# EAGLE design detection_input (EAGLE 7.6.0)
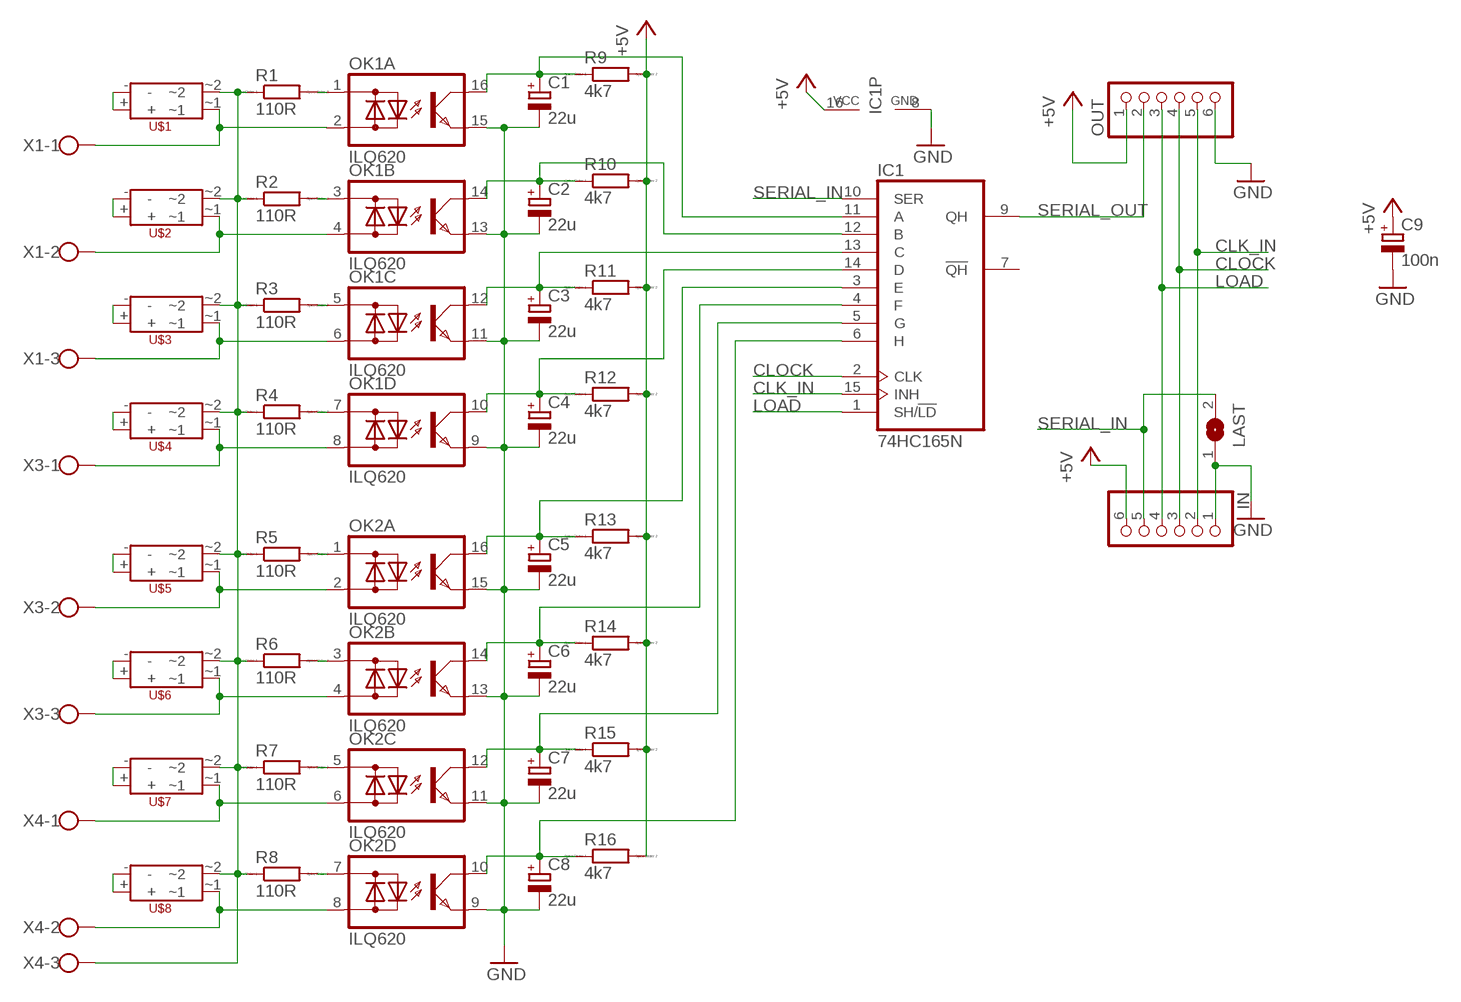
[diagram p0: schematic, sheet 1]

## Parts
C1  22u  CPOL-EUE2-4  [E2-4]
C2  22u  CPOL-EUE2-4  [E2-4]
C3  22u  CPOL-EUE2-4  [E2-4]
C4  22u  CPOL-EUE2-4  [E2-4]
C5  22u  CPOL-EUE2-4  [E2-4]
C6  22u  CPOL-EUE2-4  [E2-4]
C7  22u  CPOL-EUE2-4  [E2-4]
C8  22u  CPOL-EUE2-4  [E2-4]
C9  100n  CPOL-EUA/3216-18W  [A/3216-18W]
IC1  74HC165N  [DIL16]
IN  PINHD-1X6  [1X06]
LAST  SJ  [SJ]
OK1  ILQ620  [DIL16]
OK2  ILQ620  [DIL16]
OUT  PINHD-1X6  [1X06]
R1  110R  R0204/7  [0204/7]
R2  110R  R0204/7  [0204/7]
R3  110R  R0204/7  [0204/7]
R4  110R  R0204/7  [0204/7]
R5  110R  R0204/7  [0204/7]
R6  110R  R0204/7  [0204/7]
R7  110R  R0204/7  [0204/7]
R8  110R  R0204/7  [0204/7]
R9  4k7  R0204/7  [0204/7]
R10  4k7  R0204/7  [0204/7]
R11  4k7  R0204/7  [0204/7]
R12  4k7  R0204/7  [0204/7]
R13  4k7  R0204/7  [0204/7]
R14  4k7  R0204/7  [0204/7]
R15  4k7  R0204/7  [0204/7]
R16  4k7  R0204/7  [0204/7]
U$1  2W10  [2W10]
U$2  2W10  [2W10]
U$3  2W10  [2W10]
U$4  2W10  [2W10]
U$5  2W10  [2W10]
U$6  2W10  [2W10]
U$7  2W10  [2W10]
U$8  2W10  [2W10]
X1  W237-103  [W237-103]
X3  W237-103  [W237-103]
X4  W237-103  [W237-103]

## Nets
+5V: C9.+ IC1.16(VCC) IN.6 OUT.1 R9.2 R10.2 R11.2 R12.2 R13.2 R14.2 R15.2 R16.2
CLK_IN: IC1.15(INH) IN.2 OUT.5
CLOCK: IC1.2(CLK) IN.3 OUT.4
GND: C1.- C2.- C3.- C4.- C5.- C6.- C7.- C8.- C9.- IC1.8(GND) IN.1 LAST.1 OK1.9(D:E) OK1.11(C:E) OK1.13(B:E) OK1.15(A:E) OK2.9(D:E) OK2.11(C:E) OK2.13(B:E) OK2.15(A:E) OUT.6
LOAD: IC1.1(SH/!LD) IN.4 OUT.3
N$1: U$1.+ U$1.-
N$2: OK1.7(D:AC1) R4.2
N$3: OK1.5(C:AC1) R3.2
N$4: OK1.2(A:AC2) U$1.~1 X1.1
N$5: U$2.+ U$2.-
N$6: OK1.3(B:AC1) R2.2
N$7: OK1.1(A:AC1) R1.2
N$8: OK1.4(B:AC2) U$2.~1 X1.2
N$9: U$3.+ U$3.-
N$10: OK2.7(D:AC1) R8.2
N$11: OK2.5(C:AC1) R7.2
N$12: OK1.6(C:AC2) U$3.~1 X1.3
N$13: U$4.+ U$4.-
N$14: OK2.3(B:AC1) R6.2
N$15: OK1.8(D:AC2) U$4.~1 X3.1
N$16: U$5.+ U$5.-
N$17: R1.1 R2.1 R3.1 R4.1 R5.1 R6.1 R7.1 R8.1 U$1.~2 U$2.~2 U$3.~2 U$4.~2 U$5.~2 U$6.~2 U$7.~2 U$8.~2 X4.3
N$18: OK2.1(A:AC1) R5.2
N$19: OK2.2(A:AC2) U$5.~1 X3.2
N$20: U$6.+ U$6.-
N$21: C8.+ IC1.6(H) OK2.10(D:C) R16.1
N$22: OK2.4(B:AC2) U$6.~1 X3.3
N$23: U$7.+ U$7.-
N$24: C7.+ IC1.5(G) OK2.12(C:C) R15.1
N$25: C6.+ IC1.4(F) OK2.14(B:C) R14.1
N$26: OK2.6(C:AC2) U$7.~1 X4.1
N$27: U$8.+ U$8.-
N$28: C5.+ IC1.3(E) OK2.16(A:C) R13.1
N$29: OK2.8(D:AC2) U$8.~1 X4.2
N$30: C4.+ IC1.14(D) OK1.10(D:C) R12.1
N$31: C3.+ IC1.13(C) OK1.12(C:C) R11.1
N$32: C2.+ IC1.12(B) OK1.14(B:C) R10.1
N$33: C1.+ IC1.11(A) OK1.16(A:C) R9.1
SERIAL_IN: IC1.10(SER) IN.5 LAST.2
SERIAL_OUT: IC1.9(QH) OUT.2
Unconnected: IC1.7(!QH)

## Library data of the parts
C1-C9 = resistor:CPOL-EU: POLARIZED CAPACITOR, European symbol
IC1 = 74xx-eu:74*165: 8-bit parallel load SHIFT REGISTER
IN OUT = pinhead:PINHD-1X6: PIN HEADER
LAST = jumper:SJ: SMD solder JUMPER
OK1 OK2 = optocoupler:ILQ620: SIEMENS OPTO COUPLER; MF: VISHAY/TELEFUNKEN; MPN: ILQ620; OC_FARNELL: 1612470; OC_NEWARK: 58K1694
R1-R16 = eagle-ltspice:R: RESISTOR, European symbol; SPICEMODEL: NONE; SPICEPREFIX: R
U$1-U$8 = Custom:2W10
X1 X3 X4 = con-wago-500:W237-103: WAGO SCREW CLAMP; MPN: 237-103; OC_FARNELL: unknown; OC_NEWARK: 18M7116

## Board
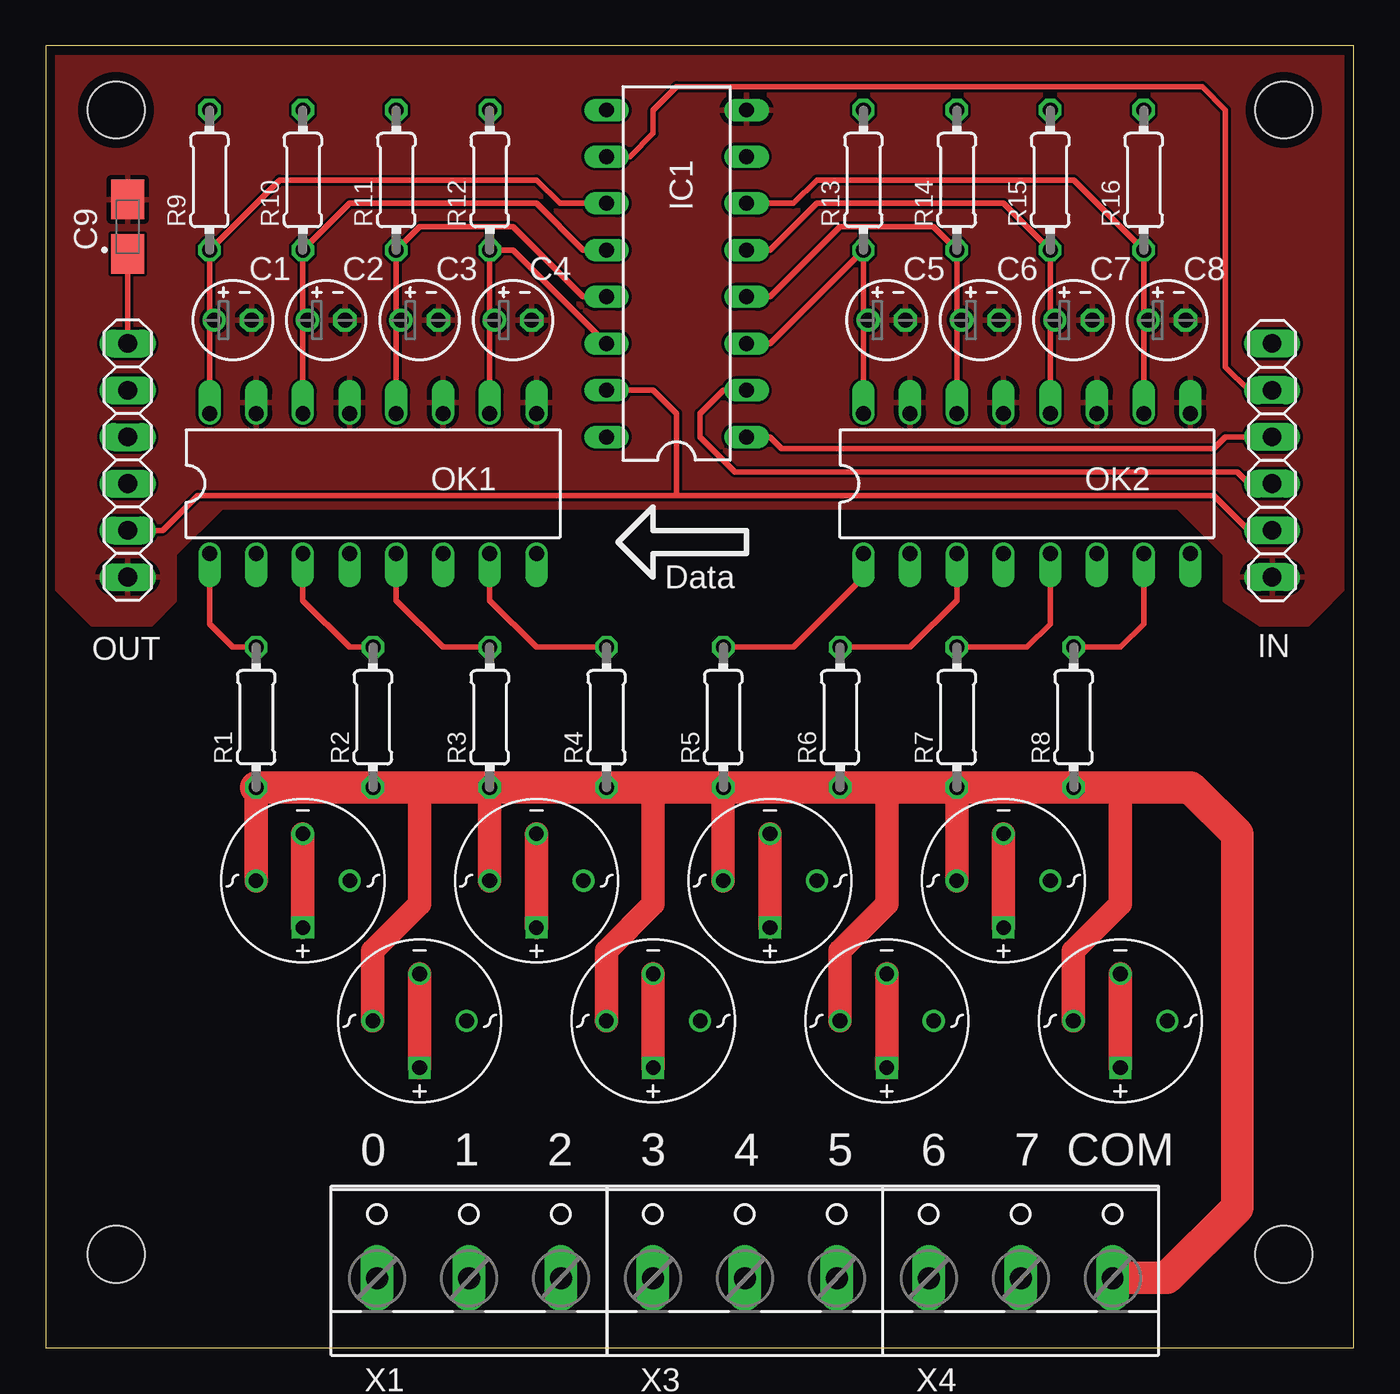
[diagram p1: board, top side]
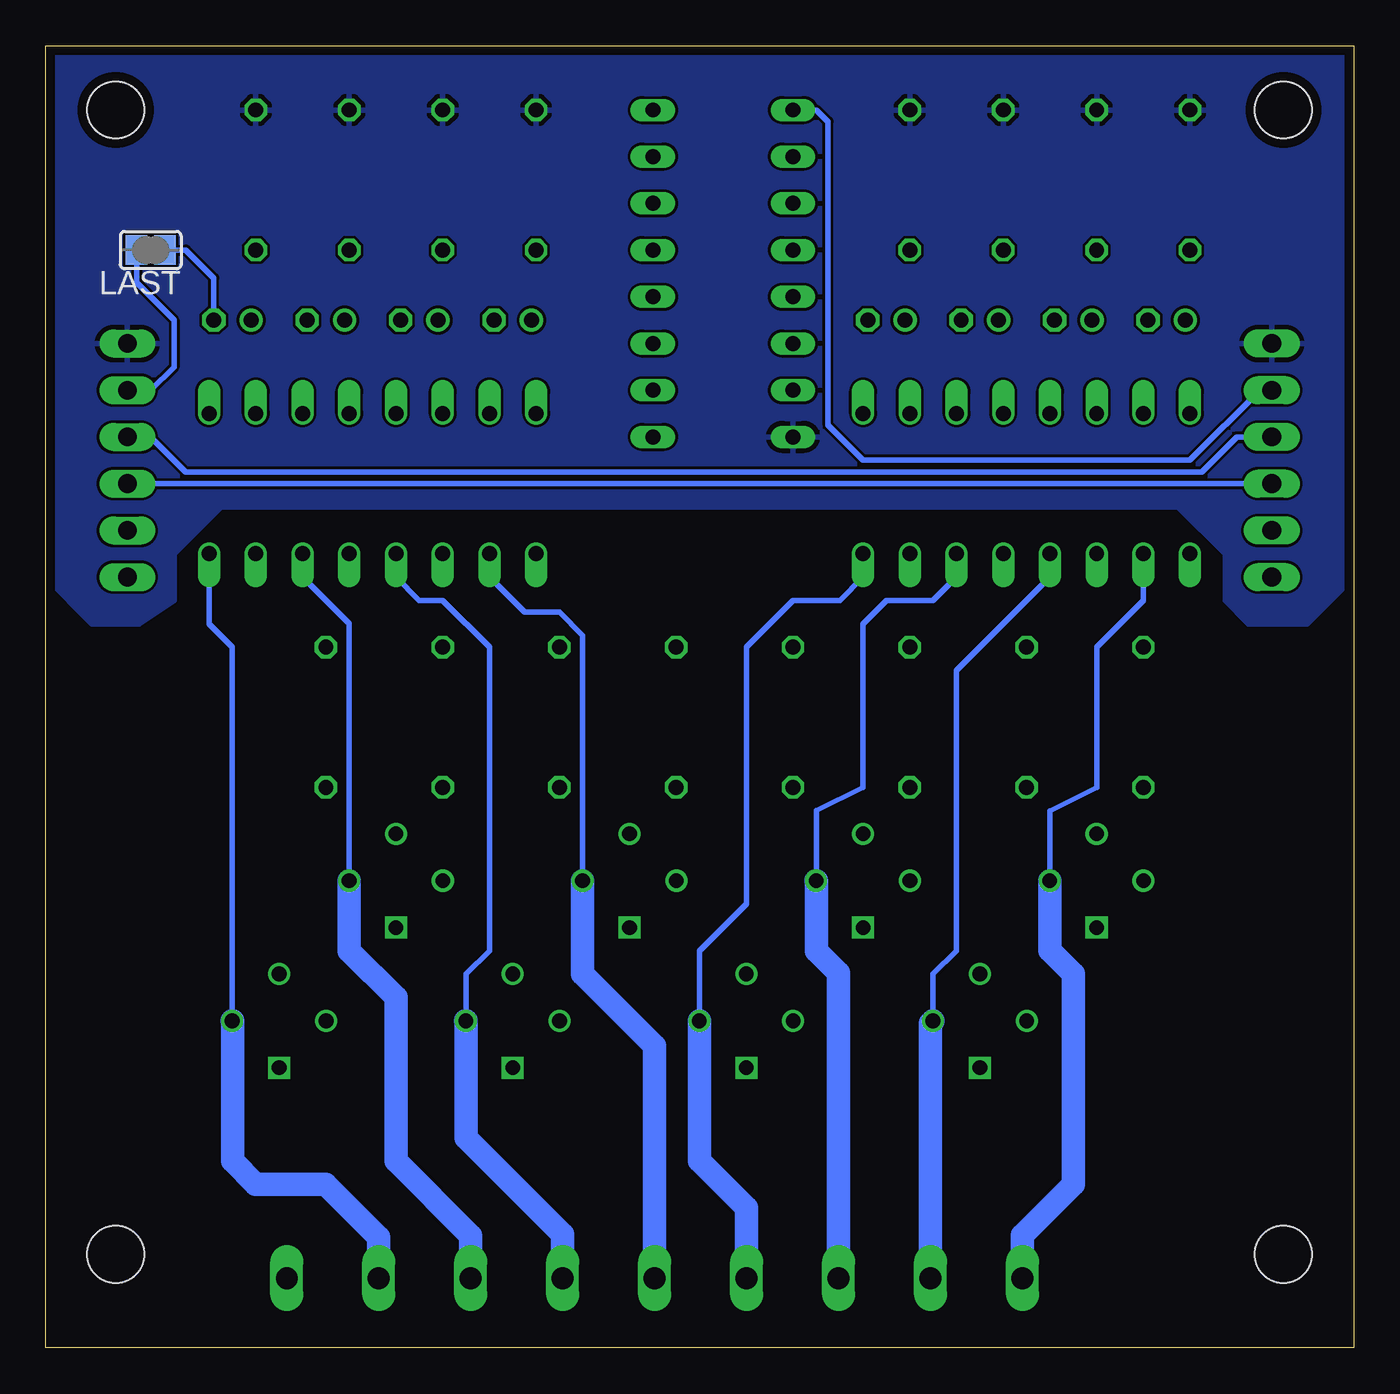
[diagram p2: board, bottom side, seen from below]

Size 71.1 x 70.79 mm. Coordinates in mm from the lower left corner, seen from the top.
Outline: 0,0 71.1,0 71.1,70.79 0,70.79 0,0
Copper layers (1*16): Top 0.035mm / dielectric 1.6mm / Bottom 0.035mm
Design rules "Elecrow_2-layer_PCB_eagle_rule": minimum track width 6mil, minimum drill 12mil, track to track 6mil, track to pad 6mil, pad to pad 6mil, via to via 8mil, smd to smd 0mil, copper to edge 20mil, drill to drill 10mil, minimum pad ring 6mil, minimum via ring 6mil, stop-mask expansion 0mil, vias tented up to drill 100mil, thermal gap 10mil
Holes 3.1 mm at 3.81,5.08 67.31,5.08 3.81,67.31 67.31,67.31

### Footprints (pad centres in the part's own frame; a part is rotated, then mirrored left to right if it is on the bottom)
E2-4 = drill 0.813 pad 1.27: + -1.016,0 | drill 0.813 pad 1.27 octagon: - 1.016,0
A/3216-18W = smd 2.15 x 1.8: + 1.475,0; - -1.475,0
DIL16 = drill 0.813 long: 1 -8.89,-3.81; 2 -6.35,-3.81; 3 -3.81,-3.81; 4 -1.27,-3.81; 5 1.27,-3.81; 6 3.81,-3.81; 7 6.35,-3.81; 8 8.89,-3.81; 9 8.89,3.81; 10 6.35,3.81; 11 3.81,3.81; 12 1.27,3.81; 13 -1.27,3.81; 14 -3.81,3.81; 15 -6.35,3.81; 16 -8.89,3.81
1X06 = drill 1.016 long: 1 -6.35,0; 2 -3.81,0; 3 -1.27,0; 4 1.27,0; 5 3.81,0; 6 6.35,0
SJ = smd 1.168 x 1.6: 1 -0.762,0; 2 0.762,0
DIL16' = drill 0.813 offset: 1 -8.89,-3.81; 2 -6.35,-3.81; 3 -3.81,-3.81; 4 -1.27,-3.81; 5 1.27,-3.81; 6 3.81,-3.81; 7 6.35,-3.81; 8 8.89,-3.81; 9 8.89,3.81; 10 6.35,3.81; 11 3.81,3.81; 12 1.27,3.81; 13 -1.27,3.81; 14 -3.81,3.81; 15 -6.35,3.81; 16 -8.89,3.81
0204/7 = drill 0.813 octagon: 1 -3.81,0; 2 3.81,0
2W10 = drill 0.8 square: + 0,2.55 | drill 0.8: - 0,-2.55; ~1 -2.55,0; ~2 2.55,0
W237-103 = drill 1.194 long: 1 -5,-1.29; 2 0,-1.29; 3 5,-1.29

### Placement (x,y rotation side)
C1  10.16,55.88 0 top
C2  15.24,55.88 0 top
C3  20.32,55.88 0 top
C4  25.4,55.88 0 top
C5  45.72,55.88 0 top
C6  50.8,55.88 0 top
C7  55.88,55.88 0 top
C8  60.96,55.88 0 top
C9  4.45,60.96 270 top
IC1  34.29,58.42 90 top
IN  66.67,48.26 90 top
LAST  65.41,59.69 180 bottom
OK1  ILQ620  [DIL16']  17.78,46.99 0 top
OK2  ILQ620  [DIL16']  53.34,46.99 0 top
OUT  4.45,48.26 270 top
R1  11.43,34.29 90 top
R2  17.78,34.29 90 top
R3  24.13,34.29 90 top
R4  30.48,34.29 90 top
R5  36.83,34.29 90 top
R6  43.18,34.29 90 top
R7  49.53,34.29 90 top
R8  55.88,34.29 90 top
R9  8.89,63.5 90 top
R10  13.97,63.5 90 top
R11  19.05,63.5 90 top
R12  24.13,63.5 90 top
R13  44.45,63.5 90 top
R14  49.53,63.5 90 top
R15  54.61,63.5 90 top
R16  59.69,63.5 90 top
U$1  13.97,25.4 180 top
U$2  20.32,17.78 180 top
U$3  26.67,25.4 180 top
U$4  33.02,17.78 180 top
U$5  39.37,25.4 180 top
U$6  45.72,17.78 180 top
U$7  52.07,25.4 180 top
U$8  58.42,17.78 180 top
X1  23,5.08 0 top
X3  38,5.08 0 top
X4  53,5.08 0 top

### Tracks (layer width: path | path; a pad name or v marks a point on that pad's centre or on a via)
+5V
  Top 0.305: C9.+ OUT.1
  pour Bottom: 5.71,39.37 6.99,40.64 6.99,43.18 9.53,45.72 61.59,45.72 64.14,43.18 64.14,40.64 66.04,39.37 68.58,39.37 71.12,41.91 71.12,71.12 0,71.12 0,41.91 2.54,39.37
CLK_IN
  Top 0.305: OUT.5 6.35,44.45 8.26,46.35 34.29,46.35 | 34.29,46.35 63.5,46.35 65.41,44.45 IN.2 | IC1.15 33.02,52.07 34.29,50.8 34.29,46.35
CLOCK
  Top 0.305: IN.3 65.41,46.99 64.77,47.62 37.47,47.62 35.56,49.53 35.56,50.8 36.83,52.07 IC1.2
  Bottom 0.305: IN.3 OUT.4
GND
  Bottom 0.305: LAST.1 63.5,59.69 61.98,58.17 C8.-
  pour Top: 5.71,39.37 6.99,40.64 6.99,43.18 9.53,45.72 61.59,45.72 64.14,43.18 64.14,40.64 66.04,39.37 68.58,39.37 71.12,41.91 71.12,71.12 0,71.12 0,41.91 2.54,39.37
LOAD
  Top 0.305: IC1.1 39.37,49.53 40.01,48.9 63.5,48.9 64.14,49.53 IN.4
  Bottom 0.305: OUT.3 6.35,49.53 8.26,47.62 63.5,47.62 65.41,49.53 IN.4
N$1
  Top 1.27: U$1.- U$1.+
N$2
  Top 0.305: R4.2 26.67,38.1 24.13,40.64 OK1.7
N$3
  Top 0.305: R3.2 21.59,38.1 19.05,40.64 OK1.5
N$4
  Bottom 0.305: U$1.~1 16.52,29.2 13.97,30.48 13.97,38.1 11.43,40.64 OK1.2
  Bottom 1.27: U$1.~1 16.52,21.6 15.24,20.32 15.24,8.89 18,6.13 X1.1
N$5
  Top 1.27: U$2.- U$2.+
N$6
  Top 0.305: R2.2 16.51,38.1 13.97,40.64 OK1.3
N$7
  Top 0.305: R1.2 10.16,38.1 8.89,39.37 OK1.1
N$8
  Bottom 0.305: OK1.4 16.51,41.91 21.59,36.83 21.59,21.59 22.86,20.32 U$2.~1
  Bottom 1.27: X1.2 23,17.65 U$2.~1
N$9
  Top 1.27: U$3.- U$3.+
N$10
  Top 0.305: R8.2 58.42,38.1 59.69,39.37 OK2.7
N$11
  Top 0.305: R7.2 53.34,38.1 54.61,39.37 OK2.5
N$12
  Bottom 0.305: OK1.6 21.59,41.91 22.86,40.64 25.4,40.64 26.67,39.37 26.67,30.48 29.21,29.21 U$3.~1
  Bottom 1.27: X1.3 28,20.38 29.21,21.59 U$3.~1
N$13
  Top 1.27: U$4.- U$4.+
N$14
  Top 0.305: R6.2 46.99,38.1 49.53,40.64 OK2.3
N$15
  Bottom 0.305: U$4.~1 35.57,21.58 33.02,24.13 33.02,38.1 30.48,40.64 27.94,40.64 26.67,41.91 OK1.8
  Bottom 1.27: U$4.~1 35.56,10.16 33,7.6 X3.1
N$16
  Top 1.27: U$5.- U$5.+
N$17
  Top 1.27: U$1.~2 R1.1 | U$2.~2 17.77,21.58 20.32,24.13 20.32,30.48 | U$3.~2 R3.1 | U$4.~2 30.47,21.58 33.02,24.13 33.02,30.48 | U$5.~2 R5.1 | U$6.~2 43.17,21.58 45.72,24.13 45.72,30.48 | U$7.~2 R7.1 | U$8.~2 55.87,21.58 58.42,24.13 58.42,30.48
  Top 1.778: R1.1 R2.1 20.32,30.48 R3.1 R4.1 33.02,30.48 R5.1 R6.1 45.72,30.48 R7.1 R8.1 58.42,30.48 62.23,30.48 64.77,27.94 64.77,7.62 60.96,3.81 58.02,3.81 X4.3
N$18
  Top 0.305: R5.2 40.64,38.1 44.45,41.91 OK2.1
N$19
  Bottom 0.305: U$5.~1 41.92,38.74 43.18,40.01 45.09,40.01 46.99,41.91 OK2.2
  Bottom 1.27: U$5.~1 41.91,20.32 38,16.41 X3.2
N$20
  Top 1.27: U$6.- U$6.+
N$21
  Top 0.305: 59.69,55.88 R16.1 55.88,63.5 41.91,63.5 40.64,62.23 IC1.6 | 59.69,55.88 OK2.10 | C8.+ 59.69,55.88
N$22
  Bottom 0.305: OK2.4 52.07,41.91 50.8,40.64 49.53,40.64 46.99,38.1 46.99,21.59 48.26,20.32 U$6.~1
  Bottom 1.27: U$6.~1 48.26,11.43 43,6.17 X3.3
N$23
  Top 1.27: U$7.- U$7.+
N$24
  Top 0.305: 54.61,55.88 R15.1 52.07,62.23 41.91,62.23 39.37,59.69 IC1.5 | 54.61,55.88 OK2.12 | C7.+ 54.61,55.88
N$25
  Top 0.305: 49.53,55.88 R14.1 48.26,60.96 43.18,60.96 39.37,57.15 IC1.4 | 49.53,55.88 OK2.14 | C6.+ 49.53,55.88
N$26
  Bottom 0.305: U$7.~1 54.62,39.38 57.15,41.91 OK2.6
  Bottom 1.27: U$7.~1 54.61,21.59 52.07,19.05 52.07,10.16 48,6.09 X4.1
N$27
  Top 1.27: U$8.- U$8.+
N$28
  Top 0.305: 44.45,55.88 R13.1 39.37,54.61 IC1.3 | 44.45,55.88 OK2.16 | C5.+ 44.45,55.88
N$29
  Bottom 0.305: U$8.~1 60.97,38.11 62.23,39.37 OK2.8
  Bottom 1.27: U$8.~1 60.96,10.16 59.69,8.89 55.88,8.89 53,6.01 X4.2
N$30
  Top 0.305: 24.13,55.88 R12.1 25.4,59.69 IC1.14 | 24.13,55.88 OK1.10 | C4.+ 24.13,55.88
N$31
  Top 0.305: 19.05,55.88 R11.1 20.32,60.96 25.4,60.96 29.21,57.15 IC1.13 | 19.05,55.88 OK1.12 | C3.+ 19.05,55.88
N$32
  Top 0.305: 13.97,55.88 R10.1 16.51,62.23 26.67,62.23 29.21,59.69 IC1.12 | 13.97,55.88 OK1.14 | C2.+ 13.97,55.88
N$33
  Top 0.305: 8.89,55.88 R9.1 12.7,63.5 26.67,63.5 27.94,62.23 IC1.11 | 8.89,55.88 OK1.16 | C1.+ 8.89,55.88
SERIAL_IN
  Top 0.305: IC1.10 31.75,64.77 33.02,66.04 33.02,67.31 34.29,68.58 62.87,68.58 64.14,67.31 64.14,53.34 65.41,52.07 IN.5
  Bottom 0.305: LAST.2 66.17,57.91 64.14,55.88 64.14,53.34 65.41,52.07 IN.5
SERIAL_OUT
  Bottom 0.305: OUT.2 5.08,52.07 8.89,48.26 26.67,48.26 28.57,50.16 28.57,66.67 29.21,67.31 IC1.9

### Text on the board
tNames: Data | 0 | 1 | 2 | 3 | 4 | 5 | 6 | 7 | COM